# EAGLE schematic talos (EAGLE 9.6.2)
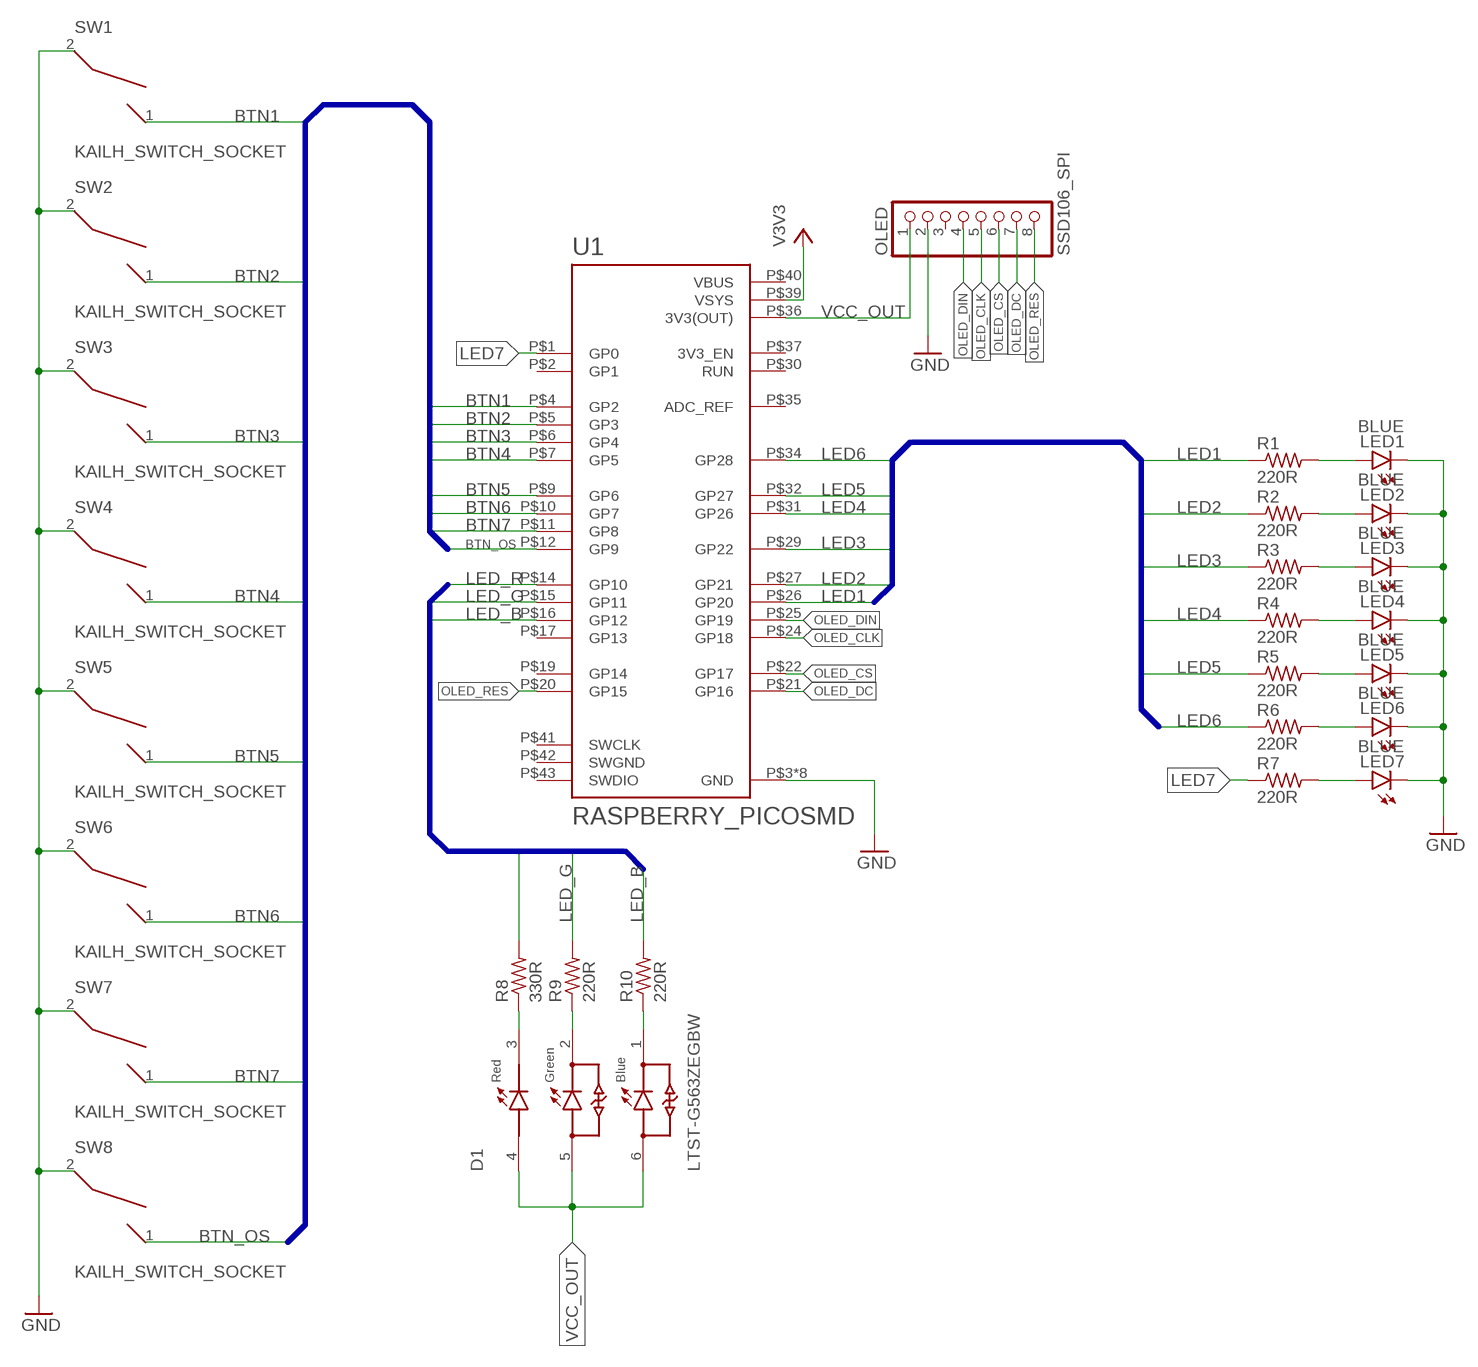
[diagram p0: schematic, sheet 1]

## Parts
D1  LTST-G563ZEGBW  [LED_LTST-G563ZEGBW]
LED1  BLUE  LEDCHIP-LED0805  [CHIP-LED0805]
LED2  BLUE  LEDCHIP-LED0805  [CHIP-LED0805]
LED3  BLUE  LEDCHIP-LED0805  [CHIP-LED0805]
LED4  BLUE  LEDCHIP-LED0805  [CHIP-LED0805]
LED5  BLUE  LEDCHIP-LED0805  [CHIP-LED0805]
LED6  BLUE  LEDCHIP-LED0805  [CHIP-LED0805]
LED7  BLUE  LEDCHIP-LED0805  [CHIP-LED0805]
OLED  SSD106_SPI  PINHD-1X8  [1X08]
R1  220R  R-US_R0805  [R0805]
R2  220R  R-US_R0805  [R0805]
R3  220R  R-US_R0805  [R0805]
R4  220R  R-US_R0805  [R0805]
R5  220R  R-US_R0805  [R0805]
R6  220R  R-US_R0805  [R0805]
R7  220R  R-US_R0805  [R0805]
R8  330R  R-US_R0805  [R0805]
R9  220R  R-US_R0805  [R0805]
R10  220R  R-US_R0805  [R0805]
SW1  KAILH_SWITCH_SOCKET  [SWITCH_SOCKET]
SW2  KAILH_SWITCH_SOCKET  [SWITCH_SOCKET]
SW3  KAILH_SWITCH_SOCKET  [SWITCH_SOCKET]
SW4  KAILH_SWITCH_SOCKET  [SWITCH_SOCKET]
SW5  KAILH_SWITCH_SOCKET  [SWITCH_SOCKET]
SW6  KAILH_SWITCH_SOCKET  [SWITCH_SOCKET]
SW7  KAILH_SWITCH_SOCKET  [SWITCH_SOCKET]
SW8  KAILH_SWITCH_SOCKET  [SWITCH_SOCKET]
U1  RASPBERRY_PICOSMD  [PICO-PKG-SMD]

## Nets
BTN1: SW1.1 U1.P$4(GP2)
BTN2: SW2.1 U1.P$5(GP3)
BTN3: SW3.1 U1.P$6(GP4)
BTN4: SW4.1 U1.P$7(GP5)
BTN5: SW5.1 U1.P$9(GP6)
BTN6: SW6.1 U1.P$10(GP7)
BTN7: SW7.1 U1.P$11(GP8)
BTN_OS: SW8.1 U1.P$12(GP9)
GND: LED1.C LED2.C LED3.C LED4.C LED5.C LED6.C LED7.C OLED.2 SW1.2 SW2.2 SW3.2 SW4.2 SW5.2 SW6.2 SW7.2 SW8.2 U1.P$3(GND) U1.P$8(GND) U1.P$13(GND) U1.P$18(GND) U1.P$23(GND) U1.P$28(GND) U1.P$33(GND) U1.P$38(GND)
LED1: R1.1 U1.P$26(GP20)
LED2: R2.1 U1.P$27(GP21)
LED3: R3.1 U1.P$29(GP22)
LED4: R4.1 U1.P$31(GP26)
LED5: R5.1 U1.P$32(GP27)
LED6: R6.1 U1.P$34(GP28)
LED7: R7.1 U1.P$1(GP0)
LED_B: R10.2 U1.P$16(GP12)
LED_G: R9.2 U1.P$15(GP11)
LED_R: R8.2 U1.P$14(GP10)
N$1: LED1.A R1.2
N$2: LED2.A R2.2
N$3: LED3.A R3.2
N$4: LED4.A R4.2
N$5: LED5.A R5.2
N$6: LED6.A R6.2
N$7: D1.3 R8.1
N$8: LED7.A R7.2
N$9: D1.1 R10.1
N$10: D1.2 R9.1
OLED_CLK: OLED.5 U1.P$24(GP18)
OLED_CS: OLED.6 U1.P$22(GP17)
OLED_DC: OLED.7 U1.P$21(GP16)
OLED_DIN: OLED.4 U1.P$25(GP19)
OLED_RES: OLED.8 U1.P$20(GP15)
VCC: U1.P$39(VSYS) ; supply symbol labelled V3V3
VCC_OUT: D1.4 D1.5 D1.6 OLED.1 U1.P$36(3V3(OUT))
Unconnected: OLED.3 U1.P$2(GP1) U1.P$17(GP13) U1.P$19(GP14) U1.P$30(RUN) U1.P$35(ADC_REF) U1.P$37(3V3_EN) U1.P$41(SWCLK) U1.P$43(SWDIO)

## Buses
BTN1,BTN2,BTN3,BTN4,BTN5,BTN6,BTN7,BTN_OS
LED1,LED2,LED3,LED4,LED5,LED6,LED7
LED_B,LED_G,LED_R,VCC_OUT

## Power pins joined to a net without a drawn wire
SWGND: U1.P$42(SWGND)
VBUS: U1.P$40(VBUS)

## Library data of the parts
D1 = LTST-G563ZEGBW:LTST-G563ZEGBW: Check availability <https://pricing.snapeda.com/parts/LTST-G563ZEGBW/Lite-On/view-part?ref=eda>; AVAILABILITY: In Stock; CHECK_PRICES: https://www.snapeda.com/parts/LTST-G563ZEGBW/Lite-On/view-part/?ref=eda; DESCRIPTION: LED; SMD; 5050, PLCC6; RGB; 5x5x1.6mm; 120°; 20mA; Lens: transparent; MF: Lite-On; MP: LTST-G563ZEGBW; PACKAGE: PLCC-6 Lite-On; PRICE: None; SNAPEDA_LINK: https://www.snapeda.com/parts/LTST-G563ZEGBW/Lite-On/view-part/?ref=snap
LED1-LED7 = led:LED: LED OSRAM: - CHIPLED LG R971, LG N971, LY N971, LG Q971, LY Q971, LO R971, LY R971 LH N974, LH R974 LS Q976, LO Q976, LY Q976 LO Q996 - Hyper CHIPLED LW Q18S LB Q993, LB Q99A, LB R99A - SideLED LS A670, LO A670, LY A670, LG A670, LP A670 LB A673, LV A673, LT A673, LW A673 LH A674 LY A675 LS A676, LA A676, LO A676, LY A676, LW A676 LS A679, LY A679, LG A679 - Hyper Micro SIDELED® LS Y876, LA Y876, LO Y876, LY Y876 LT Y87S - SmartLED LW L88C, LW L88S LB L89C, LB L89S, LG L890 LS L89K, LO L89K, LY L89K LS L896, LA L896, LO L896, LY L896 - TOPLED LS T670, LO T670, LY T670, LG T670, LP T670 LSG T670, LSP T670, LSY T670, LOP T670, LYG T670 LG T671, LOG T671, LSG T671 LB T673, LV T673, LT T673, LW T673 LH T674 LS T676, LA T676, LO T676, LY T676, LB T676, LH T676, LSB T676, LW T676 LB T67C, LV T67C, LT T67C, LS T67K, LO T67K, LY T67K, LW E67C LS E67B, LA E67B, LO E67B, LY E67B, LB E67C, LV E67C, LT E67C LW T67C LS T679, LY T679, LG T679 LS T770, LO T770, LY T770, LG T770, LP T770 LB T773, LV T773, LT T773, LW T773 LH T774 LS E675, LA E675, LY E675, LS T675 LS T776, LA T776, LO T776, LY T776, LB T776 LHGB T686 LT T68C, LB T68C - Hyper Mini TOPLED® LB M676 - Mini TOPLED Santana® LG M470 LS M47K, LO M47K, LY M47K Source: http://www.osram.convergy.de LUXEON: - LUMILED® LXK2-PW12-R00, LXK2-PW12-S00, LXK2-PW14-U00, LXK2-PW14-V00 LXK2-PM12-R00, LXK2-PM12-S00, LXK2-PM14-U00 LXK2-PE12-Q00, LXK2-PE12-R00, LXK2-PE12-S00, LXK2-PE14-T00, LXK2-PE14-U00 LXK2-PB12-K00, LXK2-PB12-L00, LXK2-PB12-M00, LXK2-PB14-N00, LXK2-PB14-P00, LXK2-PB14-Q00 LXK2-PR12-L00, LXK2-PR12-M00, LXK2-PR14-Q00, LXK2-PR14-R00 LXK2-PD12-Q00, LXK2-PD12-R00, LXK2-PD12-S00 LXK2-PH12-R00, LXK2-PH12-S00 LXK2-PL12-P00, LXK2-PL12-Q00, LXK2-PL12-R00 Source: www.luxeon.com KINGBRIGHT: KA-3528ASYC Source: www.kingbright.com
OLED = pinhead:PINHD-1X8: PIN HEADER
R1-R10 = rcl:R-US_: RESISTOR, American symbol; SPICEPREFIX: R
SW1-SW8 = Kailh_switch_socket:KAILH_SWITCH_SOCKET
U1 = RpiPico:RASPBERRY_PICO: Raspberry Pi Pico